# EAGLE design ucboard (EAGLE 6.5.0)
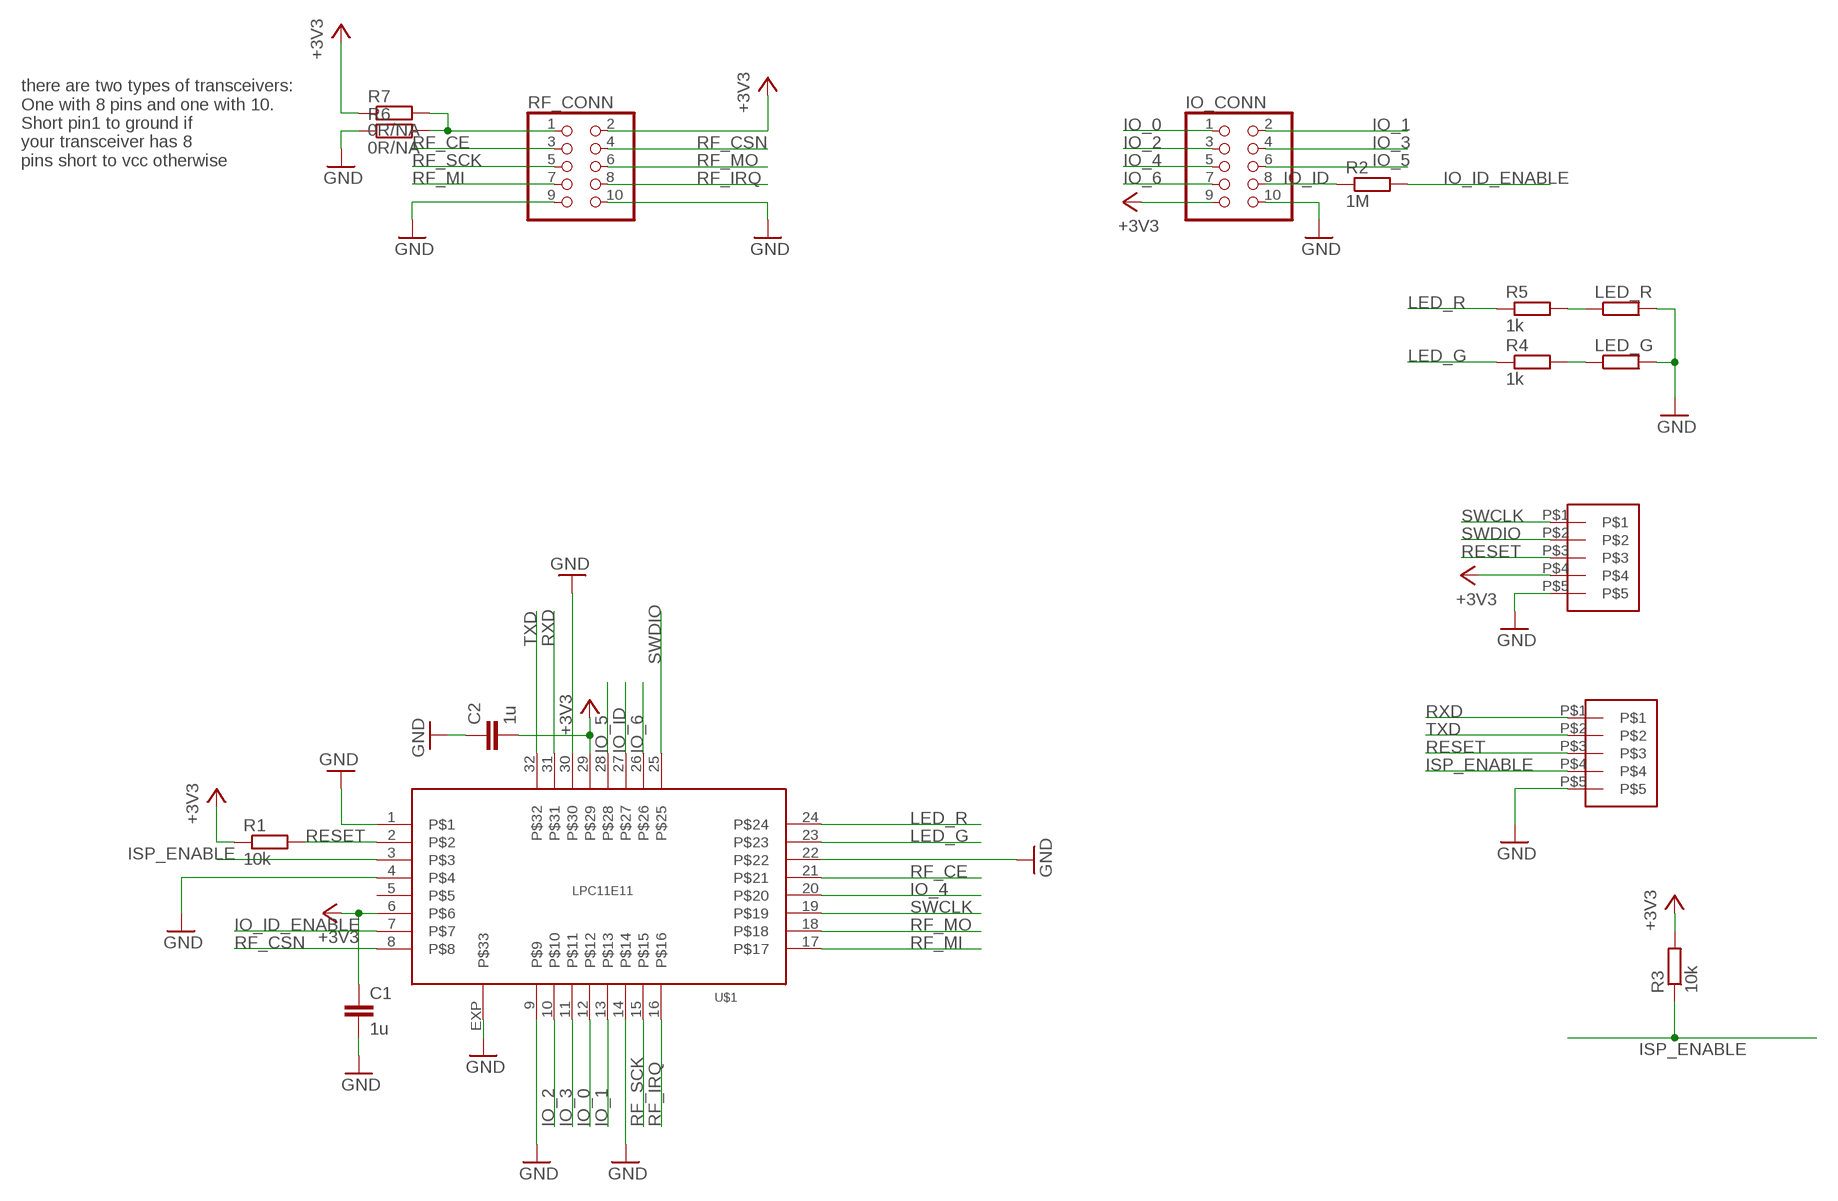
[diagram p0: schematic, sheet 1]

## Parts
C1  1u  C-EUC0603  [C0603]
C2  1u  C-EUC0603  [C0603]
DBG  005CONTACTS  [05HEADER]
IO_CONN  PINHD-2X5  [2X05]
LED_G  R-EU_R0402  [R0402]
LED_R  R-EU_R0402  [R0402]
R1  10k  R-EU_R0402  [R0402]
R2  1M  R-EU_R0402  [R0402]
R3  10k  R-EU_R0402  [R0402]
R4  1k  R-EU_R0402  [R0402]
R5  1k  R-EU_R0402  [R0402]
R6  0R/NA  R-EU_R0201  [R0201]
R7  0R/NA  R-EU_R0201  [R0201]
RF_CONN  PINHD-2X5  [2X05]
U$1  LPC11E14  [VQFN32]
UART  005CONTACTS  [05HEADER]

## Nets
+3V3: C1.1 C2.2 DBG.P$4 IO_CONN.9 R1.1 R3.2 R7.1 RF_CONN.2 U$1.6 U$1.29
GND: C1.2 C2.1 DBG.P$5 IO_CONN.10 LED_G.2 LED_R.2 R6.1 RF_CONN.9 RF_CONN.10 U$1.1 U$1.4 U$1.9 U$1.14 U$1.22 U$1.30 U$1.EXP UART.P$5
IO_0: IO_CONN.1 U$1.12
IO_1: IO_CONN.2 U$1.13
IO_2: IO_CONN.3 U$1.10
IO_3: IO_CONN.4 U$1.11
IO_4: IO_CONN.5 U$1.20
IO_5: IO_CONN.6 U$1.28
IO_6: IO_CONN.7 U$1.26
IO_ID: IO_CONN.8 R2.1 U$1.27
IO_ID_ENABLE: R2.2 U$1.7
ISP_ENABLE: R3.1 U$1.3 UART.P$4
LED_G: R4.1 U$1.23
LED_R: R5.1 U$1.24
N$1: LED_R.1 R5.2
N$2: LED_G.1 R4.2
N$4: R6.2 R7.2 RF_CONN.1
RESET: DBG.P$3 R1.2 U$1.2 UART.P$3
RF_CE: RF_CONN.3 U$1.21
RF_CSN: RF_CONN.4 U$1.8
RF_IRQ: RF_CONN.8 U$1.16
RF_MI: RF_CONN.7 U$1.17
RF_MO: RF_CONN.6 U$1.18
RF_SCK: RF_CONN.5 U$1.15
RXD: U$1.31 UART.P$1
SWCLK: DBG.P$1 U$1.19
SWDIO: DBG.P$2 U$1.25
TXD: U$1.32 UART.P$2
Unconnected: U$1.5

## Notes on the sheet
- there are two types of transceivers:
  One with 8 pins and one with 10.
  Short pin1 to ground if 
  your transceiver has 8 
  pins short to vcc otherwise

## Library data of the parts
C1 C2 = rcl:C-EU: CAPACITOR, European symbol; DIGIKEY: 1276-1024-1-ND
DBG UART = viskos:005CONTACTS
IO_CONN RF_CONN = pinhead:PINHD-2X5: PIN HEADER
LED_G = rcl:R-EU_: RESISTOR, European symbol; DIGIKEY: 754-1101-1-ND
LED_R = rcl:R-EU_: RESISTOR, European symbol; DIGIKEY: 754-1104-1-ND
R1-R7 = rcl:R-EU_: RESISTOR, European symbol
U$1 = lpc11e14:LPC11E14

## Board
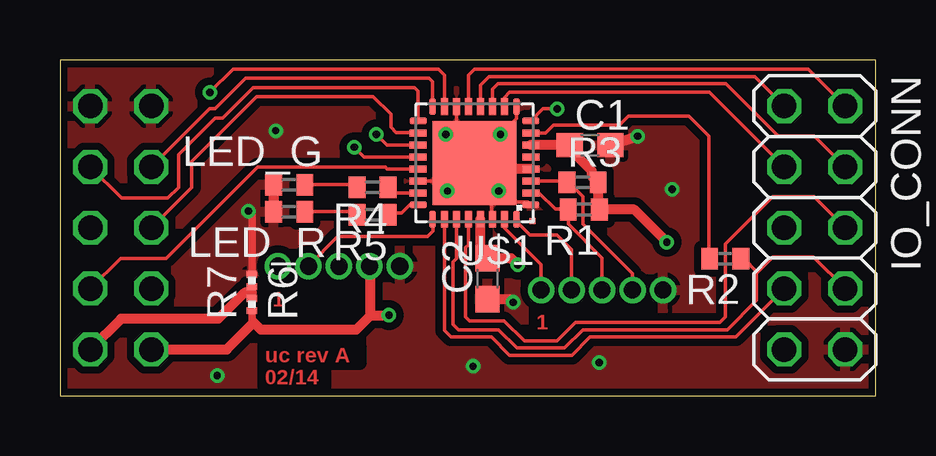
[diagram p1: board, top side]
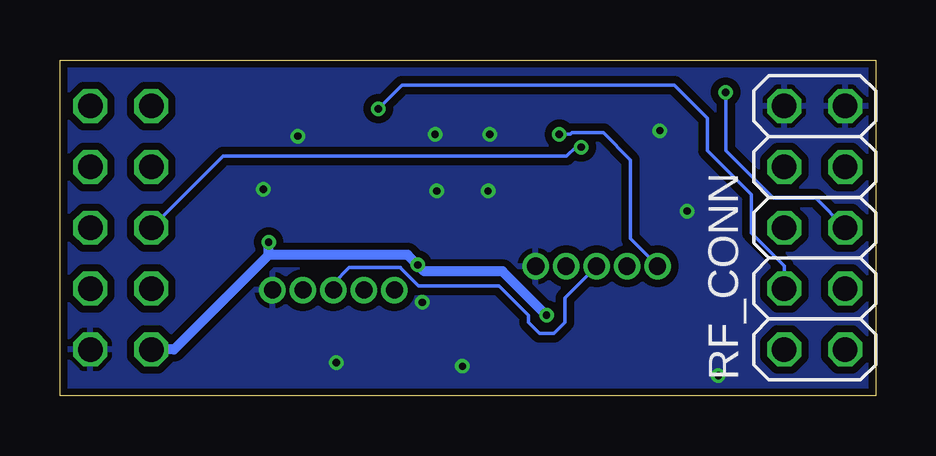
[diagram p2: board, bottom side, seen from below]

Size 34 x 14 mm. Coordinates in mm from the lower left corner, seen from the top.
Outline: 0,0 34,0 34,14 0,14 0,0
Copper layers (1*16): Top 0.035mm / dielectric 1.5mm / Bottom 0.035mm
Design rules "PCB-POOL Standard": minimum track width 0.15mm, minimum drill 0.3mm, track to track 0.15mm, track to pad 0.15mm, pad to pad 0.15mm, via to via 0.15mm, smd to smd 0.15mm, copper to edge 0.3mm, drill to drill 0.2mm, minimum pad ring 0.2mm, minimum via ring 0.15mm, stop-mask expansion 0.075mm, vias tented up to drill 0mil, thermal gap 0.2mm

### Footprints (pad centres in the part's own frame; a part is rotated, then mirrored left to right if it is on the bottom)
C0603 = smd 1.1 x 1: 1 -0.85,0; 2 0.85,0
05HEADER = drill 0.711 pad 0.762: P$1 -2.54,0; P$2 -1.27,0; P$3 0,0; P$4 1.27,0; P$5 2.54,0
2X05 = drill 1.016 octagon: 1 -5.08,-1.27; 2 -5.08,1.27; 3 -2.54,-1.27; 4 -2.54,1.27; 5 0,-1.27; 6 0,1.27; 7 2.54,-1.27; 8 2.54,1.27; 9 5.08,-1.27; 10 5.08,1.27
R0402 = smd 0.7 x 0.9: 1 -0.65,0; 2 0.65,0
R0201 = smd 0.28 x 0.43: 1 -0.255,0; 2 0.255,0
VQFN32 = smd 0.7 x 0.28: 1 -2.35,1.75; 2 -2.35,1.25; 3 -2.35,0.75; 4 -2.35,0.25; 5 -2.35,-0.25; 6 -2.35,-0.75; 7 -2.35,-1.25; 8 -2.35,-1.75; 17 2.35,-1.75; 18 2.35,-1.25; 19 2.35,-0.75; 20 2.35,-0.25; 21 2.35,0.25; 22 2.35,0.75; 23 2.35,1.25; 24 2.35,1.75 | smd 0.28 x 0.7: 9 -1.75,-2.35; 10 -1.25,-2.35; 11 -0.75,-2.35; 12 -0.25,-2.35; 13 0.25,-2.35; 14 0.75,-2.35; 15 1.25,-2.35; 16 1.75,-2.35; 25 1.75,2.35; 26 1.25,2.35; 27 0.75,2.35; 28 0.25,2.35; 29 -0.25,2.35; 30 -0.75,2.35; 31 -1.25,2.35; 32 -1.75,2.35 | smd 3.5 x 3.5: EXP 0,0 | smd 0.25 x 0.25: M1 -2.415,2.415

### Placement (x,y rotation side)
C1  22.1,10.44 0 top
C2  17.83,4.88 90 top
DBG  11.63,5.39 0 top
IO_CONN  31.46,7 270 top
LED_G  9.56,8.8 180 top
LED_R  9.56,7.67 180 top
R1  21.84,7.76 180 top
R2  27.73,5.71 180 top
R3  21.79,8.9 0 top
R4  13.03,8.69 180 top
R5  13.03,7.54 180 top
R6  8,4.8 270 top
R7  8,3.8 90 top
RF_CONN  2.54,7 90 bottom
U$1  17.28,9.7 180 top
UART  22.6,4.4 0 top

### Tracks (layer width: path | path; a pad name or v marks a point on that pad's centre or on a via)
+3V3  (via drill 0.3)
  Top 0.305: 8.08,3.05 8,3.12 arc-45 8,3.13 R7.1
  Top 0.406: RF_CONN.2 6.95,1.92 8.08,3.05 8.38,2.74 12.34,2.74 12.95,3.35 | 18.75,5.73 C2.2 17.53,6.03 U$1.29 | 12.95,3.35 v13.72,3.35 | U$1.6 21.01,10.45 C1.1 21.25,10.3 22.17,9.37 22.17,9.17 R3.2 22.44,7.81 R1.1 23.94,7.76 v25.3,6.4 | 12.95,3.35 12.95,5.34 arc45 12.95,5.34 DBG.P$4 | 18.75,5.73 arc-45 18.75,5.73 | 18.75,5.73 18.81,5.73 arc-45 18.81,5.73 v19.09,5.45
  Bottom 0.406: v13.72,3.35 15.54,5.18 18.82,5.18 arc45 18.82,5.18 v19.09,5.45 19.51,5.87 25.3,5.87 | IO_CONN.9 29.25,1.92 25.3,5.87 | 25.3,5.87 v25.3,6.4
GND  (via drill 0.3)
  Top 0.152: 17.53,9.68 17.45,9.68 17.37,9.75 17.37,9.91 v18.36,10.9 19.03,11.56 U$1.9 | U$1.22 15.74,8.95 v16.15,8.53 | U$1.14 16.53,11.35 v16.08,10.9 | v18.29,8.53 18.29,8.38 17.98,8.08 17.98,7.4 U$1.30 | 18.36,8.61 18.52,8.61 19.05,8.08 19.5,8.08 U$1.1
  Top 0.305: v7.85,7.7 8,7.55 arc-45 8,7.54 R6.1
  Top 0.406: LED_G.2 LED_R.2 | v24.08,10.82 22.94,10.45 C1.2 | C2.1 18.76,4.03 v18.9,3.89 | U$1.4 18.37,9.45 18.36,9.45 18.36,8.61 v18.29,8.53
  Top 0.5: U$1.EXP 17.53,9.68
  other vias: 6.55,0.84 17.22,1.22 22.48,1.37 8.99,11.05 25.53,8.61
  pour Bottom (isolate 0.305): 0.08,14.33 34.59,14.33 34.59,-0.53 0.08,-0.53
  pour Top (isolate 0.305): 0.15,14.1 33.83,14.1 33.83,-0.23 0.15,-0.23
IO_0
  Top 0.152: U$1.12 17.53,12.96 17.88,13.31 28.96,13.31 IO_CONN.1
IO_1
  Top 0.152: U$1.13 17.03,13.37 17.27,13.61 31.2,13.61 IO_CONN.2
IO_2
  Top 0.152: U$1.10 18.53,12.43 18.75,12.65 27.08,12.65 IO_CONN.3
IO_3
  Top 0.152: U$1.11 18.03,12.77 18.26,13.01 27.76,13.01 29.95,10.82 31.45,10.82 IO_CONN.4
IO_4  (via drill 0.3)
  Top 0.152: U$1.20 12.68,9.95 v12.27,10.36
  Bottom 0.152: v12.27,10.36 12.5,10.36 12.88,9.98 27.21,9.98 IO_CONN.5
IO_5
  Top 0.152: U$1.28 17.03,6.29 16.92,6.17 16.92,3.28 17.07,3.12 18.52,3.12 19.36,2.29 20.73,2.29 21.49,3.05 27.51,3.05 27.74,3.28 27.74,6.33 29.72,8.31 31.42,8.31 IO_CONN.6
IO_6
  Top 0.152: U$1.26 16.03,2.71 16.31,2.44 17.98,2.44 18.75,1.68 21.34,1.68 22.1,2.44 28.17,2.44 IO_CONN.7
IO_ID
  Top 0.152: U$1.27 16.53,5.71 16.38,5.56 16.38,2.97 16.61,2.74 18.29,2.74 19.05,1.98 21.03,1.98 21.79,2.74 27.81,2.74 29.03,3.96 29.03,5.11 29.07,5.14 | 29.07,5.14 29.72,5.79 31.4,5.79 IO_CONN.8 | R2.1 28.5,5.71 29.07,5.14
IO_ID_ENABLE
  Top 0.152: U$1.7 20.25,10.95 20.57,11.28 23.32,11.28 23.7,11.66 26.21,11.66 27.05,10.82 27.05,5.74 R2.2
ISP_ENABLE
  Top 0.152: U$1.3 21.09,8.95 R3.1 21.43,8.9 21.43,8.67 21.79,8.31 21.79,7.16 23.87,5.09 arc-45 23.87,5.08 UART.P$4
LED_G
  Top 0.152: U$1.23 13.92,8.45 R4.1
LED_R
  Top 0.152: U$1.24 14.58,7.95 14.25,7.62 13.76,7.62 R5.1
N$1
  Top 0.152: LED_R.1 12.25,7.67 R5.2
N$2
  Top 0.152: LED_G.1 12.27,8.79 R4.2
N$4
  Top 0.305: R6.2 8,4.3 R7.2
  Top 0.406: RF_CONN.1 2.55,3.2 6.6,3.2 7.7,4.3 8,4.3
RESET
  Top 0.152: U$1.2 19.97,8.45 20.65,7.77 21.18,7.77 R1.2 21.19,7.16 22.6,5.75 arc-45 22.6,5.75 UART.P$3
  Bottom 0.152: DBG.P$3 12.95,4.07 arc-45 12.95,4.07 12.95,3.05 13.41,2.59 arc45 13.41,2.59 14.02,2.59 14.48,3.05 arc45 14.48,3.05 14.48,3.35 15.7,4.57 arc-45 15.7,4.57 19.05,4.57 19.81,5.33 arc-45 19.81,5.33 21.95,5.33 22.6,4.68 arc-45 22.6,4.68 UART.P$3
RF_CE
  Top 0.152: RF_CONN.3 2.52,5.71 4.42,5.71 8.23,9.53 13.56,9.53 13.64,9.45 U$1.21
RF_CSN  (via drill 0.3)
  Top 0.152: v20.73,11.96 20.14,11.96 U$1.8
  Bottom 0.152: RF_CONN.4 3.81,5.41 5.18,6.78 5.18,8.38 7.01,10.21 7.01,11.58 8.38,12.95 19.74,12.95 v20.73,11.96
RF_IRQ
  Top 0.152: U$1.16 15.53,13.1 15.39,13.23 7.75,13.23 6.48,11.96 6.23,11.96 RF_CONN.8
RF_MI
  Top 0.152: U$1.17 14.93,12.71 14.78,12.85 8.05,12.85 6.78,11.58 6.48,11.58 4.95,10.06 4.95,8.69 4.5,8.23 2.58,8.23 RF_CONN.7
RF_MO
  Top 0.152: RF_CONN.6 5.49,8.68 5.49,9.75 8.2,12.47 13.06,12.47 13.79,11.73 13.79,11.2 14.02,10.97 14.91,10.97 U$1.18
RF_SCK  (via drill 0.3)
  Top 0.152: U$1.15 16.03,13.36 15.77,13.61 7.21,13.61 v6.25,12.65
  Bottom 0.152: v6.25,12.65 6.25,10.21 4.27,8.23 2.5,8.23 RF_CONN.5
RXD
  Top 0.152: U$1.31 18.53,6.99 20.06,5.46 arc-45 20.06,5.46 UART.P$1
SWCLK  (via drill 0.3)
  Top 0.152: U$1.19 13.63,10.45 v13.18,10.9
  Bottom 0.152: v13.18,10.9 12.72,10.9 12.65,10.97 11.35,10.97 10.21,9.83 10.21,6.55 9.09,5.43 arc45 9.09,5.43 DBG.P$1
SWDIO
  Top 0.152: U$1.25 15.54,7.34 15.54,6.86 15.32,6.63 11.58,6.63 10.36,5.41 arc45 10.36,5.4 DBG.P$2
TXD
  Top 0.152: U$1.32 19.03,7.26 19.58,6.71 20.73,6.71 21.33,6.1 arc-45 21.33,6.1 UART.P$2

### Text on the board
Top: 1 | 1 | uc rev A | 02/14
tDocu: FEMALE / BOTTOM | MALE / TOP